# EAGLE design BMP180 breakout v02 (EAGLE 6.4)
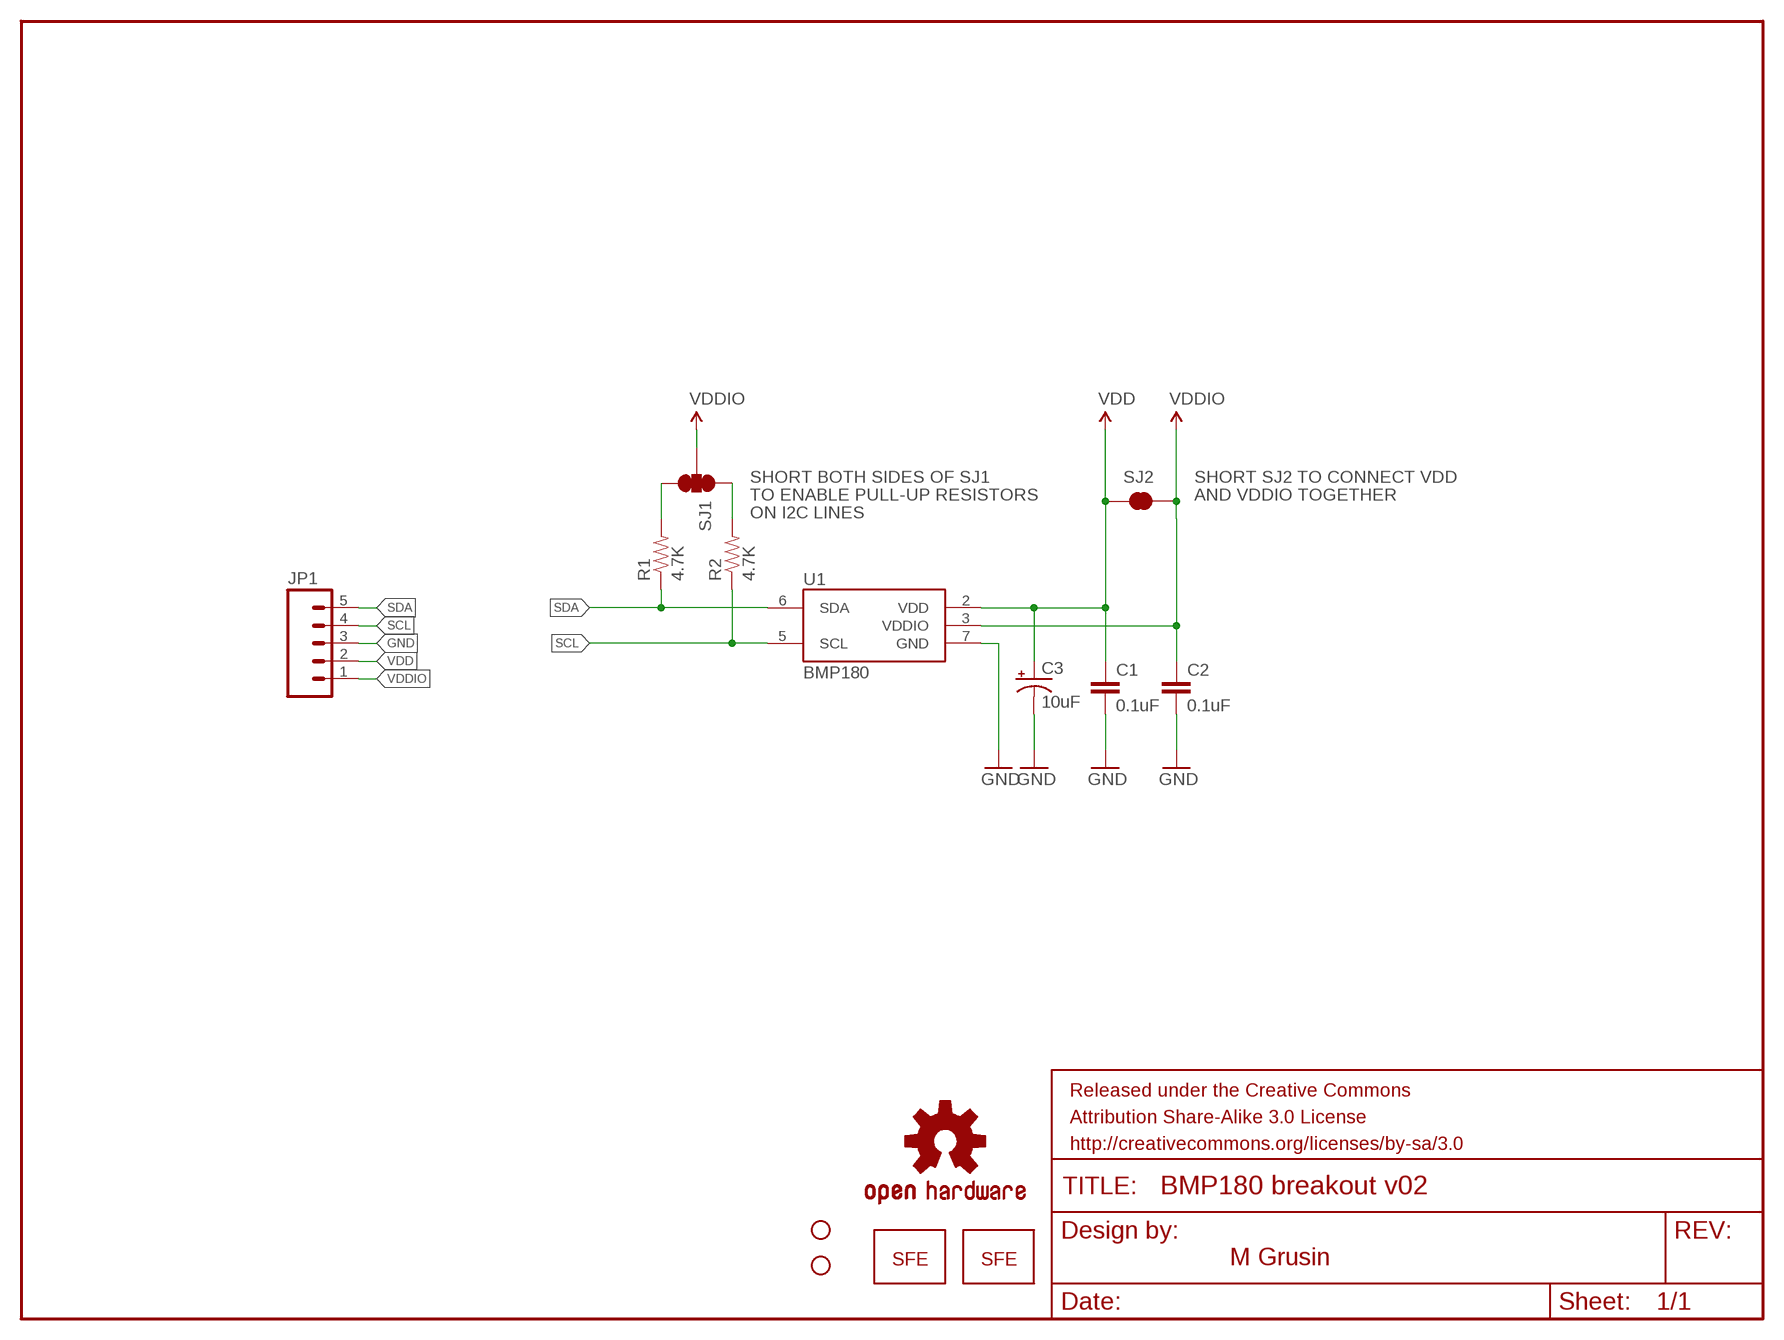
[diagram p0: schematic, sheet 1]

## Parts
C1  0.1uF  CAP0603-CAP  [0603-CAP]
C2  0.1uF  CAP0603-CAP  [0603-CAP]
C3  10uF  10UF-16V-10%(TANT)  [EIA3216]
FRAME1  FRAME-LETTER  [CREATIVE_COMMONS]
JP1  M05_ROUNDONLY_NOSILK  [1X05_ROUNDONLY_NOSILK]
LOGO1  LOGO-SFENW2  [SFE-NEW-WEB]
LOGO2  OSHW-LOGOS  [OSHW-LOGO-S]
LOGO3  LOGO-SFESK  [SFE-LOGO-FLAME]
R1  4.7K  RESISTOR0603-RES  [0603-RES]
R2  4.7K  RESISTOR0603-RES  [0603-RES]
SJ1  SOLDERJUMPER_2WAYPASTE1&2&3  [SJ_3_PASTE1&2&3]
SJ2  SOLDERJUMPERNC  [SJ_2S]
STANDOFF1  STAND-OFF  [STAND-OFF]
STANDOFF2  STAND-OFF  [STAND-OFF]
U1  BMP180  [BMP180]

## Nets
GND: C1.2 C2.2 C3.C(-) JP1.3 U1.7(GND)
N$1: R1.2 SJ1.3
N$2: R2.2 SJ1.1
SCL: JP1.4 R2.1 U1.5(SCL)
SDA: JP1.5 R1.1 U1.6(SDA)
VDD: C1.1 C3.A(+) JP1.2 SJ2.1 U1.2(VDD)
VDDIO: C2.1 JP1.1 SJ1.2 SJ2.2 U1.3(VDDIO)

## Notes on the sheet
- SHORT BOTH SIDES OF SJ1 | SHORT SJ2 TO CONNECT VDD
- TO ENABLE PULL-UP RESISTORS | AND VDDIO TOGETHER
- ON I2C LINES
- M Grusin

## Library data of the parts
C1 C2 = SparkFun-Capacitors:CAP: Capacitor Standard 0603 ceramic capacitor, and 0.1" leaded capacitor.
C3 = SparkFun-Capacitors:10UF-16V-10%(TANT): CAP-00811 1206/EIA-3216 Tantalum capacitor; PROD_ID: CAP-00811
FRAME1 = SparkFun-Aesthetics:FRAME-LETTER: Schematic Frame Standard 8.5x11 US Letter frame
JP1 = mike-temp:M05: Header 5 Standard 5-pin 0.1" header. Use with straight break away headers (SKU : PRT-00116), right angle break away headers (PRT-00553), swiss pins (PRT-00743), machine pins (PRT-00117), and female headers (PRT-00115). Molex polarized connector foot print use with SKU : PRT-08230 with associated crimp pins and housings.
LOGO1 LOGO3 = SparkFun-Aesthetics:LOGO-SFE: Spark Fun Electronics PCB Logo This is the standard Spark Fun Electronics PCB logo.
LOGO2 = SparkFun-Aesthetics:OSHW-LOGO: Open Source Hardware Logo This logo indicates the piece of hardware it is found on incorporates a OSHW license and/or adheres to the definition of open source hardware found here: http://freedomdefined.org/OSHW
R1 R2 = SparkFun-Passives:RESISTOR: Resistor Basic schematic elements and footprints for 0603, 1206, and PTH resistors.
SJ1 = mike-temp:SOLDERJUMPER_2WAY: Solder Jumper 2 way solder jumper
SJ2 = mike-temp:SOLDERJUMPER: Solder Jumper Standard SMD solder jumper. Used to automate production. Two varients : Normally Open and Normally Closed are the same, but have different paste layers. NC will have a large amount of paste and should jumper during reflow.
STANDOFF1 STANDOFF2 = SparkFun-Electromechanical:STAND-OFF: #4 Stand Off This is the mechanical footprint for a #4 phillips button head screw. Use the keepout ring to avoid running the screw head into surrounding components. SKU : PRT-00447
U1 = mike-temp:BMP180

## Board
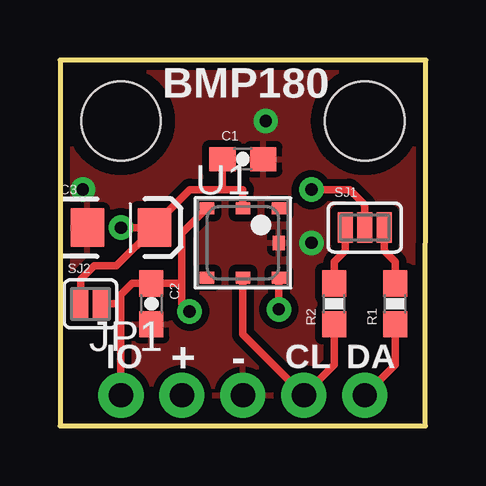
[diagram p1: board, top side]
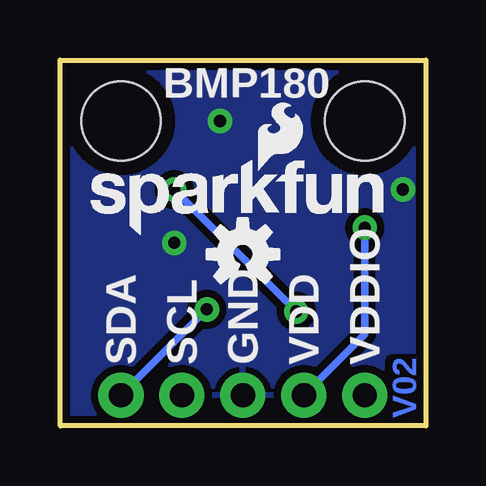
[diagram p2: board, bottom side, seen from below]

Size 15.24 x 15.24 mm. Coordinates in mm from the lower left corner, seen from the top.
Outline: 0,0 15.22,0 15.24,15.24 0,15.24 0,0
Copper layers (1*16): Top 0.035mm / dielectric 1.5mm / Bottom 0.035mm
Design rules "SparkFun *": minimum track width 7mil, minimum drill 15mil, track to track 8mil, track to pad 8mil, pad to pad 8mil, via to via 8mil, smd to smd 8mil, copper to edge 8mil, drill to drill 8mil, minimum pad ring 12mil, minimum via ring 10mil, stop-mask expansion 4mil, vias tented up to drill 20mil, thermal gap 10mil

### Footprints (pad centres in the part's own frame; a part is rotated, then mirrored left to right if it is on the bottom)
0603-CAP = smd 1.1 x 1: 1 -0.85,0; 2 0.85,0
EIA3216 = smd 1.4 x 1.6: A 1.4,0; C -1.4,0
1X05_ROUNDONLY_NOSILK = drill 1.016 pad 1.88: 1 0,0; 2 2.54,0; 3 5.08,0; 4 7.62,0; 5 10.16,0
0603-RES = smd 1.1 x 1: 1 -0.85,0; 2 0.85,0
SJ_3_PASTE1&2&3 = smd 0.635 x 1.27: 1 -0.813,0; 2 0,0; 3 0.813,0
SJ_2S = smd 0.635 x 1.27: 1 -0.412,0; 2 0.412,0
STAND-OFF = hole 3.302: 0,0
BMP180 = smd 0.6 x 0.5: 1 1.5,1.45; 2 0,1.45; 3 -1.5,1.45; 4 -1.5,-1.45; 5 0,-1.45; 6 1.5,-1.45 | smd 0.5 x 0.6: 7 1.5,0

### Placement (x,y rotation side)
C1  7.62,11.11 0 top
C2  3.81,5.08 270 top
C3  2.54,8.26 0 top
FRAME1  -25.4,-10.16 0 top  (outside the outline)
JP1  2.54,1.27 0 top
LOGO1  13.97,7.94 0 bottom
LOGO2  7.62,7.14 0 bottom
LOGO3  6.99,10.64 0 bottom
R1  13.97,5.08 90 top
R2  11.43,5.08 90 top
SJ1  12.7,8.26 0 top
SJ2  1.27,5.08 0 top
STANDOFF1  12.7,12.7 0 top
STANDOFF2  2.54,12.7 0 top
U1  7.62,7.62 0 top

### Tracks (layer width: path | path; a pad name or v marks a point on that pad's centre or on a via)
GND  (via drill 0.51)
  other vias: 10.48,7.62 8.57,12.7 0.95,9.84
  pour Bottom (isolate 0.305): 0,15.24 0,0 15.24,0 15.24,15.24
  pour Top (isolate 0.305): 0,15.24 0,0 15.24,0 15.24,15.24
N$1
  Top 0.305: SJ1.3 13.51,7.28 13.97,6.83 R1.2
N$2
  Top 0.305: SJ1.1 11.89,7.28 11.43,6.83 R2.2
SCL
  Top 0.305: R2.1 11.43,2.54 JP1.4 7.62,3.81 U1.5
SDA  (via drill 0.51)
  Top 0.305: R1.1 13.97,2.54 JP1.5 | U1.6 v9.12,4.85
  Bottom 0.305: v9.12,4.85 JP1.5
VDD  (via drill 0.51)
  Top 0.305: C3.A 3.94,8.38 5.4,9.84 6.77,9.84 | C1.1 6.77,9.84 | 6.77,9.84 7.62,9.84 U1.2 | SJ2.1 0.86,6.1 1.43,6.67 2.35,6.67 C3.A | v2.54,8.26 C3.A
  Bottom 0.305: v2.54,8.26 2.54,3.81 JP1.2
VDDIO  (via drill 0.51)
  Top 0.305: JP1.1 2.54,5.08 | 2.54,5.08 SJ2.2 | 2.54,5.08 2.54,5.46 3.01,5.93 C2.1 5.08,5.93 | U1.3 5.08,8.03 5.08,6.35 5.08,5.93 | 5.08,5.93 5.08,5.08 v5.4,4.76 | v10.48,9.84 12.06,9.84 12.7,9.21 SJ1.2
  Bottom 0.305: v5.4,4.76 v10.48,9.84

### Text on the board
Bottom: V02
tPlace: BMP180 | IO | + | - | CL | DA
bPlace: BMP180 | VDDIO | VDD | GND | SCL | SDA
tValues: M Grusin
Measures: 0.125 X 2